# Altium schematic sheet 1_POWER.SchDoc: AX309   Http://www.heijin.org
size A4; DocumentNumber: 1; Revision: 1.0; SheetNumber: 2; SheetTotal: 8; PageSetup: Record=PageOptions|CenterHorizontal=True|CenterVertical=True|PrintScale=1.00|XCorrection=1.00|YCorrection=1.00|PrintKind=0|BorderSize=5000000|LeftOffset=0|BottomOffset=0|Orientation=2|PaperLength=1000|PaperWidth=1000|Scale=100|PaperSource=7|PrintQuality=-4|MediaType=1|DitherType=10|PrintScaleMode=1|PaperKind=A4|PaperIndex=9
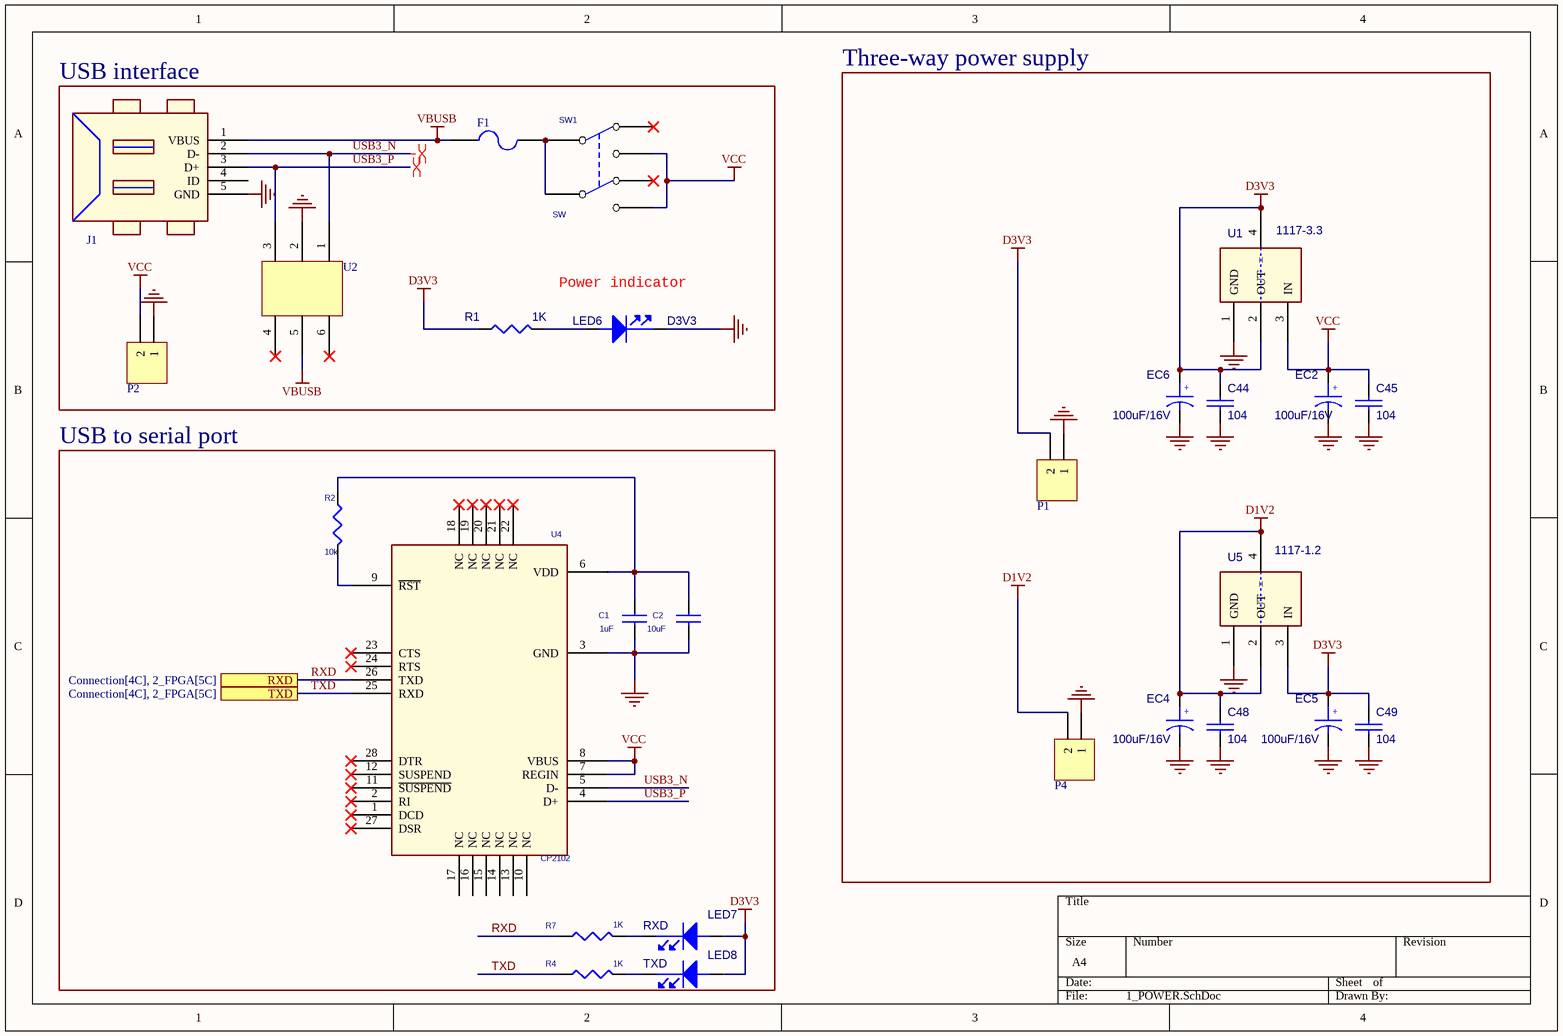
[diagram p0: 1_POWER.SchDoc]

## Parts
C1  1uF  [0603]
C2  10uF  [0805]
C44  104  [0402]
C45  104  [0402]
C48  104  [0402]
C49  104  [0402]
EC2  100uF/16V  [AEC6.5]
EC4  100uF/16V  [AEC6.5]
EC5  100uF/16V  [AEC6.5]
EC6  100uF/16V  [AEC6.5]
F1  (no value)  [1206]
J1  EC2  [MINIUSBB]  (value not drawn)
LED6  D3V3  [LEDSO]
LED7  RXD  [LEDSO]
LED8  TXD  [LEDSO]
P1  3.3V  [HDR1X2]  (value not drawn)
P2  5V  [HDR1X2]  (value not drawn)
P4  1.2V  [HDR1X2]  (value not drawn)
R1  1K  [0603]
R2  10k  [0603]
R4  1K  [0603]
R7  1K  [0603]
SW1  SW  [KEY_DPDT]
U1  1117-3.3  [SOT223]
U2  (no value)  [SOT23-6]
U4  CP2102  [QFN28]
U5  1117-1.2  [SOT223]

## Blocks framed on the sheet
USB interface: F1 J1 LED6 P2 R1 SW1 U2
Three-way power supply: C44 C45 C48 C49 EC2 EC4-EC6 P1 P4 U1 U5
USB to serial port: C1 C2 LED7 LED8 R2 R4 R7 U4

## Ports
RXD (see Connection[4C], 2_FPGA[5C]), TXD (see Connection[4C], 2_FPGA[5C])

## Nets
D1V2: C48.1 EC4.1 P4.2 U5.2(OUT) U5.4(=)
D3V3: C44.1 C49.1 EC5.1 EC6.1 LED7.1(ANODE) LED8.1(ANODE) P1.2 R1.1 U1.2(OUT) U1.4(=) U5.3(IN)
GND: C1.2 C2.2 C44.2 C45.2 C48.2 C49.2 EC2.2 EC4.2 EC5.2 EC6.2 J1.5(GND) LED6.2(CATHODE) P1.1 P2.1 P4.1 U1.1(GND) U2.2 U4.3(GND) U5.1(GND)
VBUSB: F1.1 J1.1(VBUS) U2.5
VCC: C45.1 EC2.1 P2.2 SW1.3(NO1) SW1.6(NO2) U1.3(IN) U4.7(REGIN) U4.8(VBUS)
RXD: R7.1 U4.26(TXD) ; port RXD
TXD: R4.1 U4.25(RXD) ; port TXD
USB3_N: J1.2(D-) U2.1 U4.5(D-)
USB3_P: J1.3(D+) U2.3 U4.4(D+)
NetC1_1: C1.1 C2.1 R2.2 U4.6(VDD)
NetF1_2: F1.2 SW1.2(COMMON1) SW1.5(COMMON2)
NetLED6_1: LED6.1(ANODE) R1.2
NetLED7_2: LED7.2(CATHODE) R7.2
NetLED8_2: LED8.2(CATHODE) R4.2
NetR2_1: R2.1 U4.9(~{RST})

Not connected (* = marked no-connect by the designer): J1 4(ID); SW1 1(NC1)* 4(NC2)*; U2 4* 6*; U4 1(DCD)* 2(RI)* 10(NC) 11(~{SUSPEND})* 12(SUSPEND)* 13(NC) 14(NC) 15(NC) 16(NC) 17(NC) 18(NC)* 19(NC)* 20(NC)* 21(NC)* 22(NC)* 23(CTS)* 24(RTS)* 27(DSR)* 28(DTR)*

## Layout directives
differential pair: USB3_N, USB3_P

## Notes on the sheet
- Power indicator
- Title
- Size:
- Date:
- A4
- Number:
- Time:
- Revision:
- Sheet
- of
- File:
- (in symbol EC) +

## Library data of the parts
C1 C2 = CAP NP_Dup2
C44 C45 C48 C49 = C_Dup4
EC2 EC4-EC6 = EC
F1 = Fuse 2: Fuse; Published: 8-Jun-2000; LatestRevisionDate: 17-Jul-2002; LatestRevisionNote: Re-released for DXP Platform.; PackageReference: PIN-W2/E2.8; Publisher: Altium Limited; PackageDescription: Thru-Hole; 2 Leads
J1 = MiniUSBB: R50: J5
LED6 = LED_Dup1
LED7 LED8 = LED
P1 P2 P4 = Header 2: Header, 2-Pin; LatestRevisionDate: 17-Jul-2002; LatestRevisionNote: Re-released for DXP Platform.; Publisher: Altium Limited
R1 = R
R2 = RESISTOR
R4 R7 = R_Dup3
SW1 = SW KEY-DPDT
U2 = SRV05-4
U4 = CP2102_0
U5 = 1117-3.3